# EAGLE schematic BMS Enerdel Adapter rev7 (EAGLE 9.6.2)
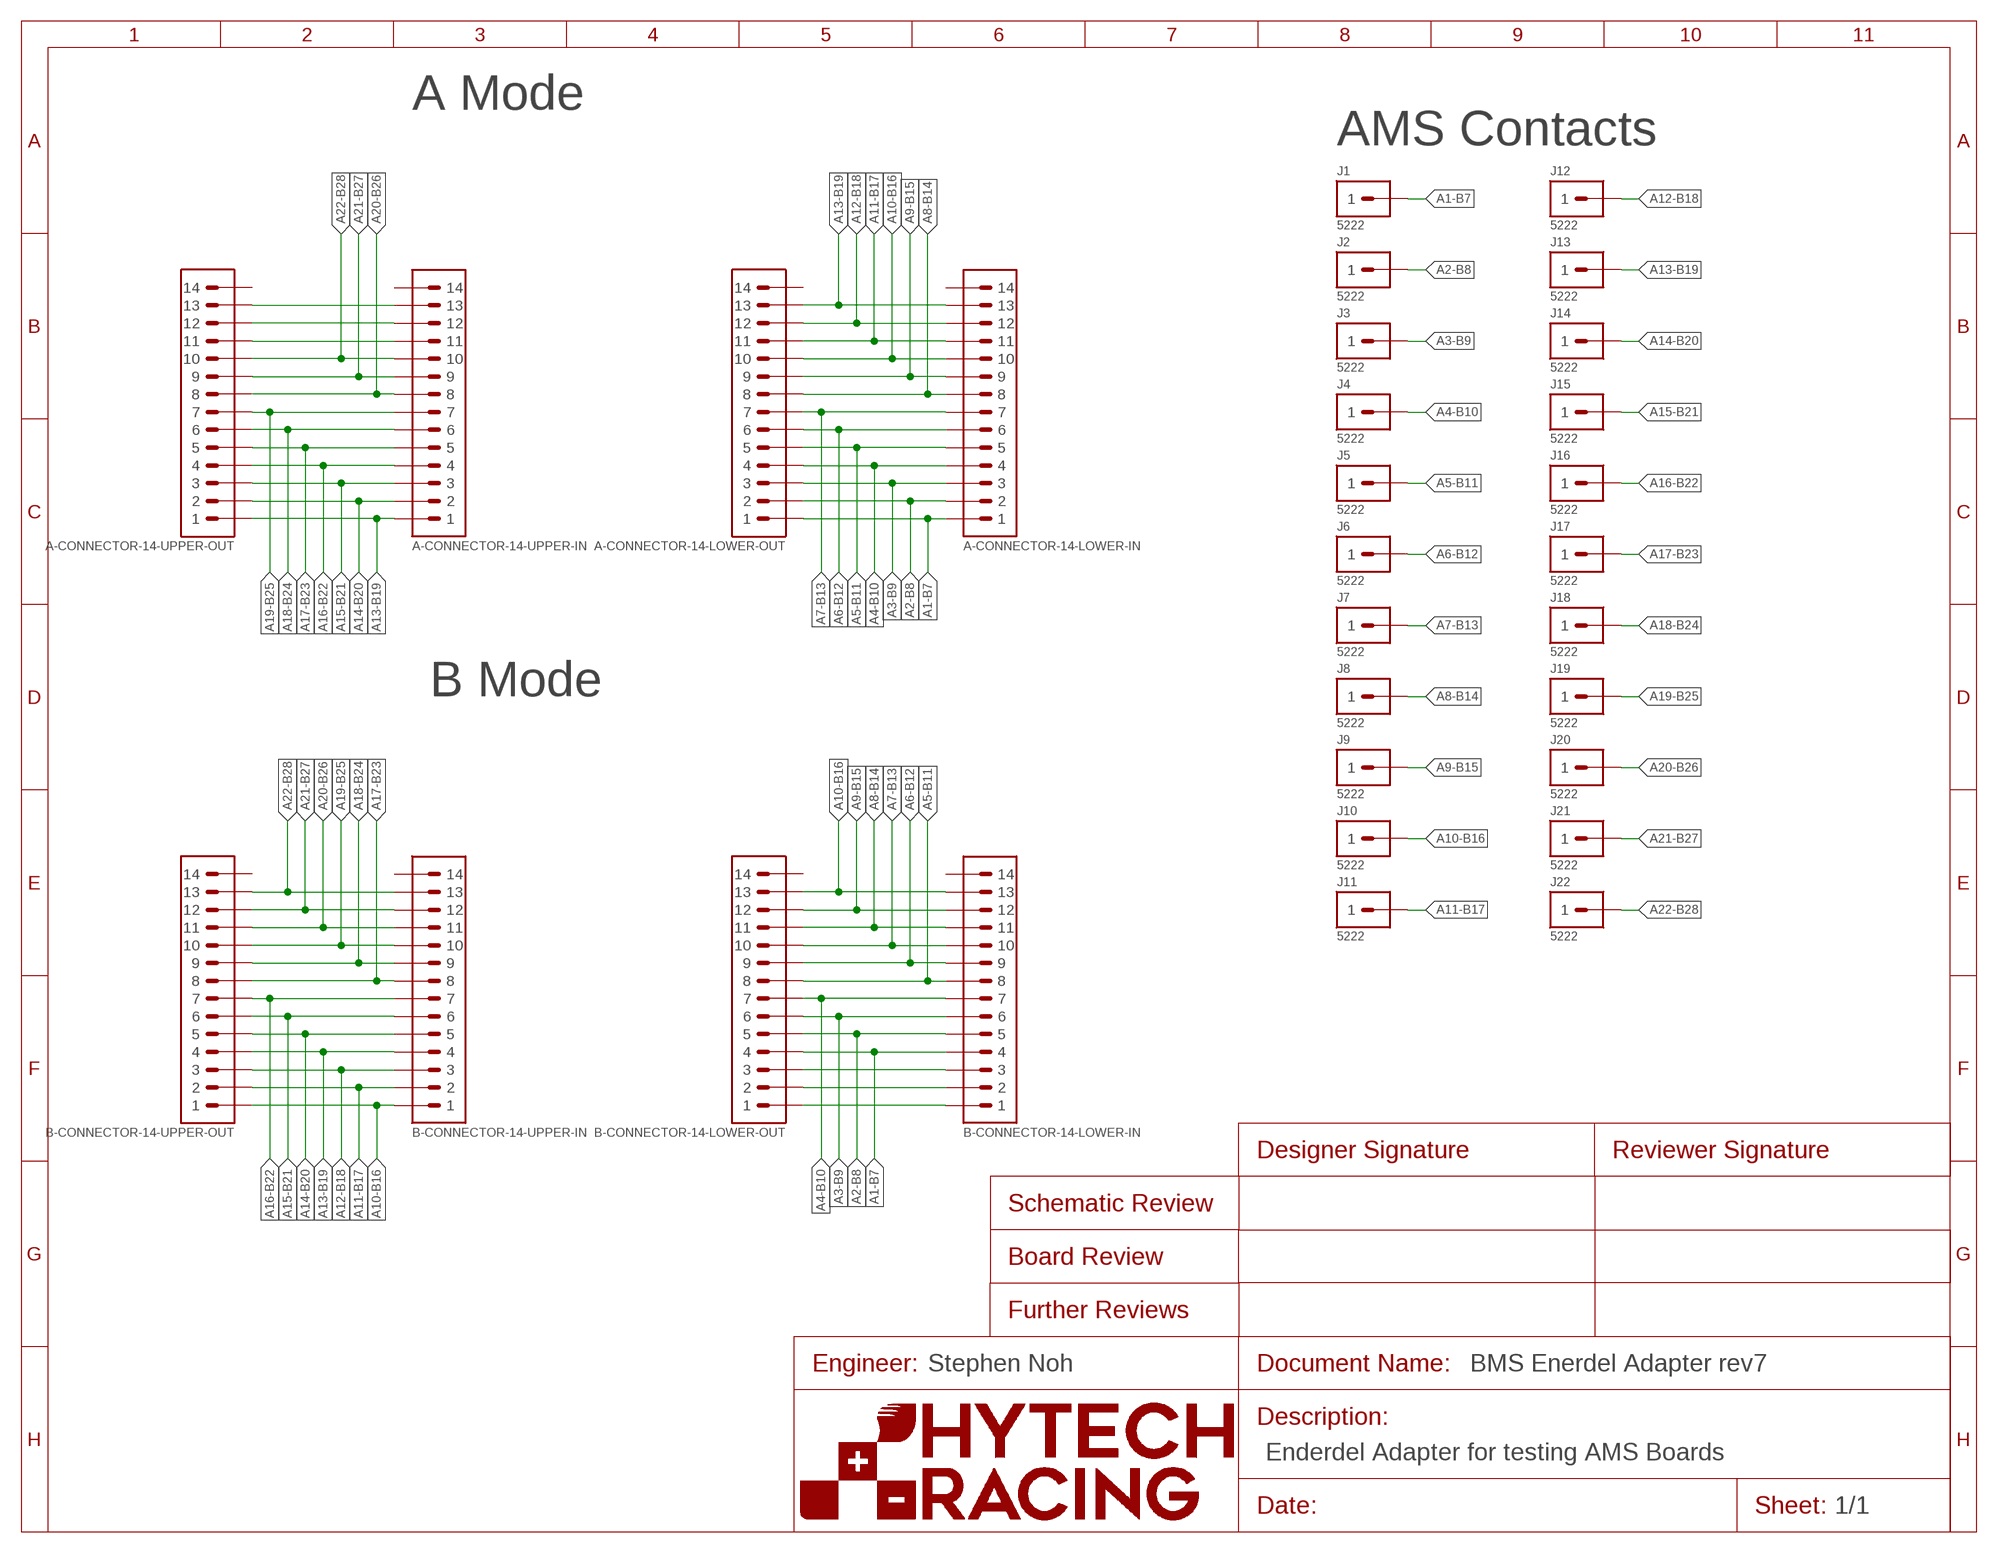
[diagram p0: schematic, sheet 1]

## Parts
A-CONNECTOR-14-LOWER-IN  CONNECTOR-14_MINIFIT_  [MOLEX_MINIFIT_PTH_14]
A-CONNECTOR-14-LOWER-OUT  CONNECTOR-14_MINIFIT_  [MOLEX_MINIFIT_PTH_14]
A-CONNECTOR-14-UPPER-IN  CONNECTOR-14_NANOFIT_  [MOLEX_NANOFIT_PTH_14]
A-CONNECTOR-14-UPPER-OUT  CONNECTOR-14_NANOFIT_  [MOLEX_NANOFIT_PTH_14]
B-CONNECTOR-14-LOWER-IN  CONNECTOR-14_MINIFIT_  [MOLEX_MINIFIT_PTH_14]
B-CONNECTOR-14-LOWER-OUT  CONNECTOR-14_MINIFIT_  [MOLEX_MINIFIT_PTH_14]
B-CONNECTOR-14-UPPER-IN  CONNECTOR-14_NANOFIT_  [MOLEX_NANOFIT_PTH_14]
B-CONNECTOR-14-UPPER-OUT  CONNECTOR-14_NANOFIT_  [MOLEX_NANOFIT_PTH_14]
J1  CONNECTOR-1_5222_  [5222]
J2  CONNECTOR-1_5222_  [5222]
J3  CONNECTOR-1_5222_  [5222]
J4  CONNECTOR-1_5222_  [5222]
J5  CONNECTOR-1_5222_  [5222]
J6  CONNECTOR-1_5222_  [5222]
J7  CONNECTOR-1_5222_  [5222]
J8  CONNECTOR-1_5222_  [5222]
J9  CONNECTOR-1_5222_  [5222]
J10  CONNECTOR-1_5222_  [5222]
J11  CONNECTOR-1_5222_  [5222]
J12  CONNECTOR-1_5222_  [5222]
J13  CONNECTOR-1_5222_  [5222]
J14  CONNECTOR-1_5222_  [5222]
J15  CONNECTOR-1_5222_  [5222]
J16  CONNECTOR-1_5222_  [5222]
J17  CONNECTOR-1_5222_  [5222]
J18  CONNECTOR-1_5222_  [5222]
J19  CONNECTOR-1_5222_  [5222]
J20  CONNECTOR-1_5222_  [5222]
J21  CONNECTOR-1_5222_  [5222]
J22  CONNECTOR-1_5222_  [5222]

## Nets
A1-B7: A-CONNECTOR-14-LOWER-IN.1 A-CONNECTOR-14-LOWER-OUT.1 B-CONNECTOR-14-LOWER-IN.4 B-CONNECTOR-14-LOWER-OUT.4 J1.1
A2-B8: A-CONNECTOR-14-LOWER-IN.2 A-CONNECTOR-14-LOWER-OUT.2 B-CONNECTOR-14-LOWER-IN.5 B-CONNECTOR-14-LOWER-OUT.5 J2.1
A3-B9: A-CONNECTOR-14-LOWER-IN.3 A-CONNECTOR-14-LOWER-OUT.3 B-CONNECTOR-14-LOWER-IN.6 B-CONNECTOR-14-LOWER-OUT.6 J3.1
A4-B10: A-CONNECTOR-14-LOWER-IN.4 A-CONNECTOR-14-LOWER-OUT.4 B-CONNECTOR-14-LOWER-IN.7 B-CONNECTOR-14-LOWER-OUT.7 J4.1
A5-B11: A-CONNECTOR-14-LOWER-IN.5 A-CONNECTOR-14-LOWER-OUT.5 B-CONNECTOR-14-LOWER-IN.8 B-CONNECTOR-14-LOWER-OUT.8 J5.1
A6-B12: A-CONNECTOR-14-LOWER-IN.6 A-CONNECTOR-14-LOWER-OUT.6 B-CONNECTOR-14-LOWER-IN.9 B-CONNECTOR-14-LOWER-OUT.9 J6.1
A7-B13: A-CONNECTOR-14-LOWER-IN.7 A-CONNECTOR-14-LOWER-OUT.7 B-CONNECTOR-14-LOWER-IN.10 B-CONNECTOR-14-LOWER-OUT.10 J7.1
A8-B14: A-CONNECTOR-14-LOWER-IN.8 A-CONNECTOR-14-LOWER-OUT.8 B-CONNECTOR-14-LOWER-IN.11 B-CONNECTOR-14-LOWER-OUT.11 J8.1
A9-B15: A-CONNECTOR-14-LOWER-IN.9 A-CONNECTOR-14-LOWER-OUT.9 B-CONNECTOR-14-LOWER-IN.12 B-CONNECTOR-14-LOWER-OUT.12 J9.1
A10-B16: A-CONNECTOR-14-LOWER-IN.10 A-CONNECTOR-14-LOWER-OUT.10 B-CONNECTOR-14-LOWER-IN.13 B-CONNECTOR-14-LOWER-OUT.13 B-CONNECTOR-14-UPPER-IN.1 B-CONNECTOR-14-UPPER-OUT.1 J10.1
A11-B17: A-CONNECTOR-14-LOWER-IN.11 A-CONNECTOR-14-LOWER-OUT.11 B-CONNECTOR-14-UPPER-IN.2 B-CONNECTOR-14-UPPER-OUT.2 J11.1
A12-B18: A-CONNECTOR-14-LOWER-IN.12 A-CONNECTOR-14-LOWER-OUT.12 B-CONNECTOR-14-UPPER-IN.3 B-CONNECTOR-14-UPPER-OUT.3 J12.1
A13-B19: A-CONNECTOR-14-LOWER-IN.13 A-CONNECTOR-14-LOWER-OUT.13 A-CONNECTOR-14-UPPER-IN.1 A-CONNECTOR-14-UPPER-OUT.1 B-CONNECTOR-14-UPPER-IN.4 B-CONNECTOR-14-UPPER-OUT.4 J13.1
A14-B20: A-CONNECTOR-14-UPPER-IN.2 A-CONNECTOR-14-UPPER-OUT.2 B-CONNECTOR-14-UPPER-IN.5 B-CONNECTOR-14-UPPER-OUT.5 J14.1
A15-B21: A-CONNECTOR-14-UPPER-IN.3 A-CONNECTOR-14-UPPER-OUT.3 B-CONNECTOR-14-UPPER-IN.6 B-CONNECTOR-14-UPPER-OUT.6 J15.1
A16-B22: A-CONNECTOR-14-UPPER-IN.4 A-CONNECTOR-14-UPPER-OUT.4 B-CONNECTOR-14-UPPER-IN.7 B-CONNECTOR-14-UPPER-OUT.7 J16.1
A17-B23: A-CONNECTOR-14-UPPER-IN.5 A-CONNECTOR-14-UPPER-OUT.5 B-CONNECTOR-14-UPPER-IN.8 B-CONNECTOR-14-UPPER-OUT.8 J17.1
A18-B24: A-CONNECTOR-14-UPPER-IN.6 A-CONNECTOR-14-UPPER-OUT.6 B-CONNECTOR-14-UPPER-IN.9 B-CONNECTOR-14-UPPER-OUT.9 J18.1
A19-B25: A-CONNECTOR-14-UPPER-IN.7 A-CONNECTOR-14-UPPER-OUT.7 B-CONNECTOR-14-UPPER-IN.10 B-CONNECTOR-14-UPPER-OUT.10 J19.1
A20-B26: A-CONNECTOR-14-UPPER-IN.8 A-CONNECTOR-14-UPPER-OUT.8 B-CONNECTOR-14-UPPER-IN.11 B-CONNECTOR-14-UPPER-OUT.11 J20.1
A21-B27: A-CONNECTOR-14-UPPER-IN.9 A-CONNECTOR-14-UPPER-OUT.9 B-CONNECTOR-14-UPPER-IN.12 B-CONNECTOR-14-UPPER-OUT.12 J21.1
A22-B28: A-CONNECTOR-14-UPPER-IN.10 A-CONNECTOR-14-UPPER-OUT.10 B-CONNECTOR-14-UPPER-IN.13 B-CONNECTOR-14-UPPER-OUT.13 J22.1
B-PASS1: B-CONNECTOR-14-LOWER-IN.3 B-CONNECTOR-14-LOWER-OUT.3
B-PASS2: B-CONNECTOR-14-LOWER-IN.2 B-CONNECTOR-14-LOWER-OUT.2
B-PASS3: B-CONNECTOR-14-LOWER-IN.1 B-CONNECTOR-14-LOWER-OUT.1
N$5: A-CONNECTOR-14-UPPER-IN.11 A-CONNECTOR-14-UPPER-OUT.11
N$6: A-CONNECTOR-14-UPPER-IN.12 A-CONNECTOR-14-UPPER-OUT.12
N$7: A-CONNECTOR-14-UPPER-IN.13 A-CONNECTOR-14-UPPER-OUT.13
Unconnected: A-CONNECTOR-14-LOWER-IN.14 A-CONNECTOR-14-LOWER-OUT.14 A-CONNECTOR-14-UPPER-IN.14 A-CONNECTOR-14-UPPER-OUT.14 B-CONNECTOR-14-LOWER-IN.14 B-CONNECTOR-14-LOWER-OUT.14 B-CONNECTOR-14-UPPER-IN.14 B-CONNECTOR-14-UPPER-OUT.14

## Notes on the sheet
- A Mode
- AMS Contacts
- B Mode
- Stephen Noh
- Enderdel Adapter for testing AMS Boards

## Library data of the parts
A-CONNECTOR-14-LOWER-IN A-CONNECTOR-14-LOWER-OUT A-CONNECTOR-14-UPPER-IN A-CONNECTOR-14-UPPER-OUT B-CONNECTOR-14-LOWER-IN B-CONNECTOR-14-LOWER-OUT B-CONNECTOR-14-UPPER-IN B-CONNECTOR-14-UPPER-OUT = HyTechDevices:CONNECTOR-14_?_*
J1-J22 = HyTechDevices:CONNECTOR-1_?_*: 1 Pin Connector Pogo pin datasheet <https://www.mouser.com/datasheet/2/273/Mill-Max_03212019_807-22-001-10-020101-1545127.pdf> 5222 Spring datasheet <https://www.mouser.com/datasheet/2/215/5222-743174.pdf>; DKPN: 36-5222-ND; MANUFACTURER: Keystone Electronics; MODEL: SPRING; MOPN: 534-5222; MPN: 5222